# Altium project signal_conversion_board_2+3channels.PrjPcb
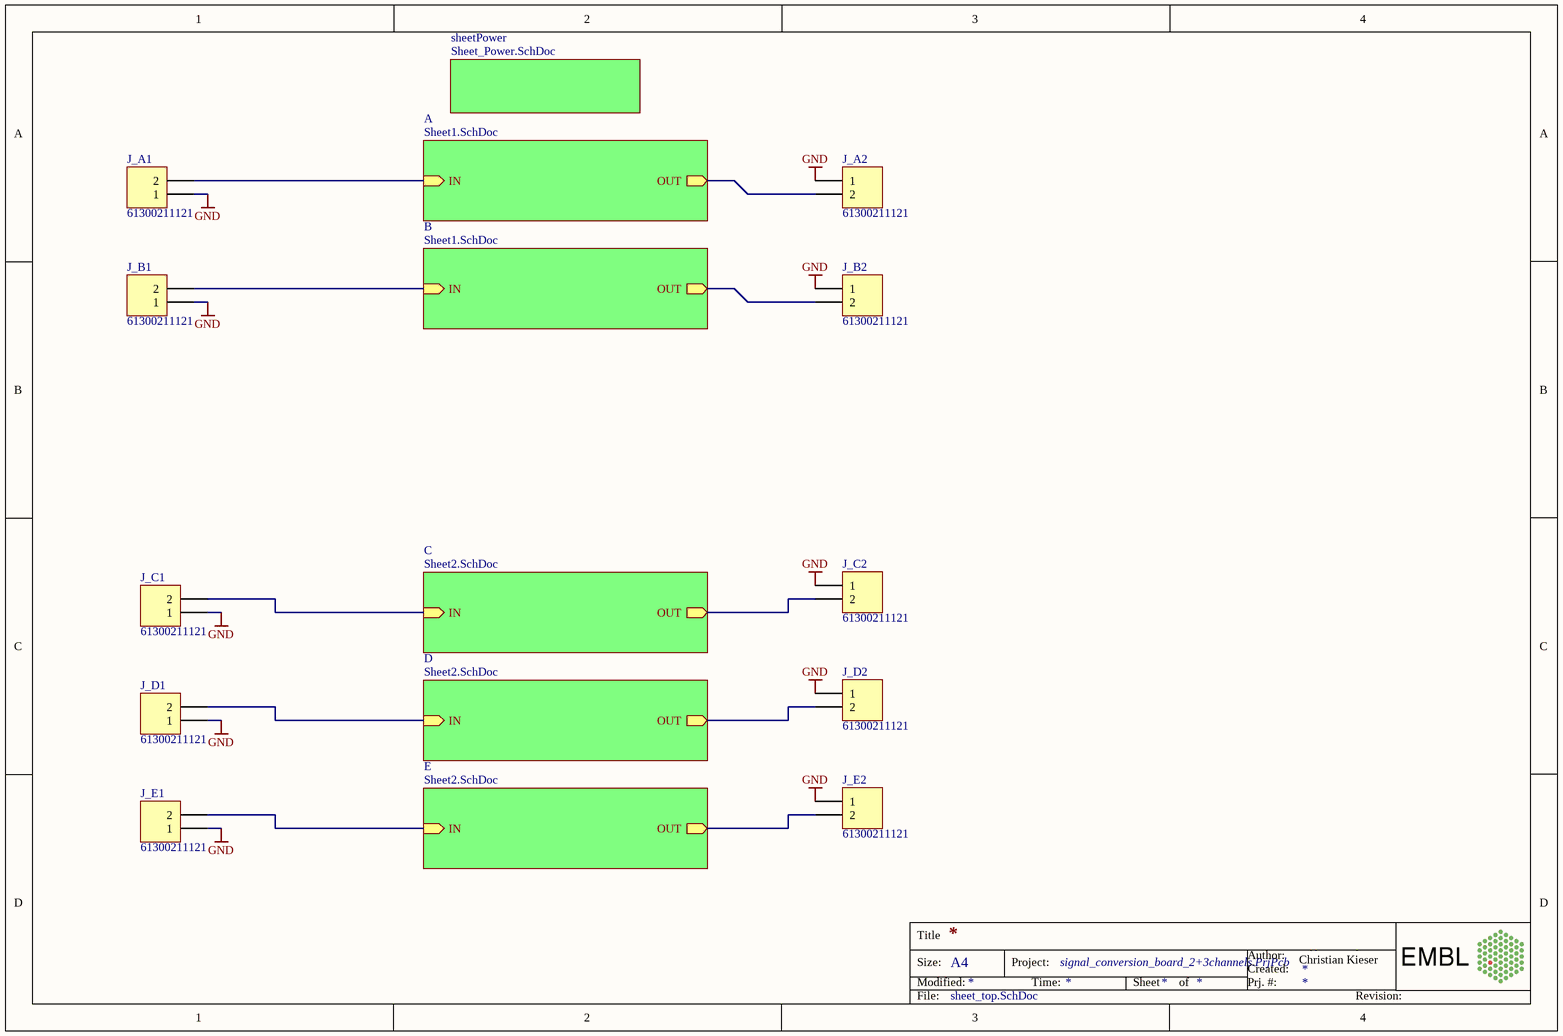
[diagram p0: sheet_top.SchDoc]
4 sheets, 112 parts. Net scope: hierarchical (ports join the sheet entries above them; power ports are global).
Board file: board.PcbDoc
Sheets:
  sheet_top.SchDoc
    sheetPower = Sheet_Power.SchDoc
    A = Sheet1.SchDoc
    B = Sheet1.SchDoc
    C = Sheet2.SchDoc
    D = Sheet2.SchDoc
    E = Sheet2.SchDoc

## Sheet sheet_top.SchDoc
size A4

### Parts
J_A1  61300211121  [61300211121]
J_A2  61300211121  [61300211121]
J_B1  61300211121  [61300211121]
J_B2  61300211121  [61300211121]
J_C1  61300211121  [61300211121]
J_C2  61300211121  [61300211121]
J_D1  61300211121  [61300211121]
J_D2  61300211121  [61300211121]
J_E1  61300211121  [61300211121]
J_E2  61300211121  [61300211121]

### Sub-sheets
A = Sheet1.SchDoc: OUT (out), IN (in)
B = Sheet1.SchDoc: OUT (out), IN (in)
C = Sheet2.SchDoc: OUT (out), IN (in)
D = Sheet2.SchDoc: OUT (out), IN (in)
E = Sheet2.SchDoc: OUT (out), IN (in)
sheetPower = Sheet_Power.SchDoc: no entries

### Nets
GND: J_A1.1 J_A2.1 J_B1.1 J_B2.1 J_C1.1 J_C2.1 J_D1.1 J_D2.1 J_E1.1 J_E2.1
NetJ11_A_2: J_A2.2 ; sheet A/OUT
NetJ11_B_2: J_B2.2 ; sheet B/OUT
NetJ_A1_2: J_A1.2 ; sheet A/IN
NetJ_B1_2: J_B1.2 ; sheet B/IN
NetJ_C1_2: J_C1.2 ; sheet C/IN
NetJ_C2_2: J_C2.2 ; sheet C/OUT
NetJ_D1_2: J_D1.2 ; sheet D/IN
NetJ_D2_2: J_D2.2 ; sheet D/OUT
NetJ_E1_2: J_E1.2 ; sheet E/IN
NetJ_E2_2: J_E2.2 ; sheet E/OUT

### Notes on the sheet
- Christian Kieser
- Title
- Size:
- Modified:
- A4
- Project:
- Time:
- Sheet
- of
- Created:
- Author:
- Prj. #:
- Alfons Riedinger
- File:
- Revision:

### Library data of the parts
J_A1 J_A2 J_B1 J_B2 J_C1 J_C2 J_D1 J_D2 J_E1 J_E2 = CMP-001-0071-1: 2Pol; gerade; WR-PHD 2.54 mm THT Pin Header; Brand: Wurth Electronics; Current Rating: 3 A; Insulation Resistance: 1 GOhms; Latching Type: Unlatched; Mating Post Length: 6 mm; Mounting Angle: Straight; Number of Positions: 2 Position; Pitch: 2.54 mm; Voltage Rating: 250 V; Accessory Type: -; Application: Wire to Board; ComponentLink1Description: 6130xx11121-538006.pdf; ComponentLink1URL: http://www.mouser.com/ds/2/445/6130xx11121-538006.pdf; Contact Gender: Pin (Male); Contact Material: Copper Alloy; Contact Plating: Gold; Contact Type: -; Flammability Rating: UL 94 V-0; Housing Gender: -; Housing Material: Polybutylene Terephthalate (PBT); Manufacturer: Wurth Electronics; Manufacturer Part Number: 61300211121; Minimum Order Quantity: 1; Mounting Style: Straight Pin; Number of Rows: 1 Row; Packaging: Bulk; Product: Headers; Reeling: False; RoHS - Mouser: Y; Row Spacing: -; Series: WR-PHD; Standard Pack Qty: 1000; Supplier: Mouser; Supplier Part Number: 710-61300211121; Termination Post Length: 3 mm; Termination Style: Through Hole; Type: Pin Strip; PartNumber: 61300211121

## Sheet Sheet_Power.SchDoc
size A4
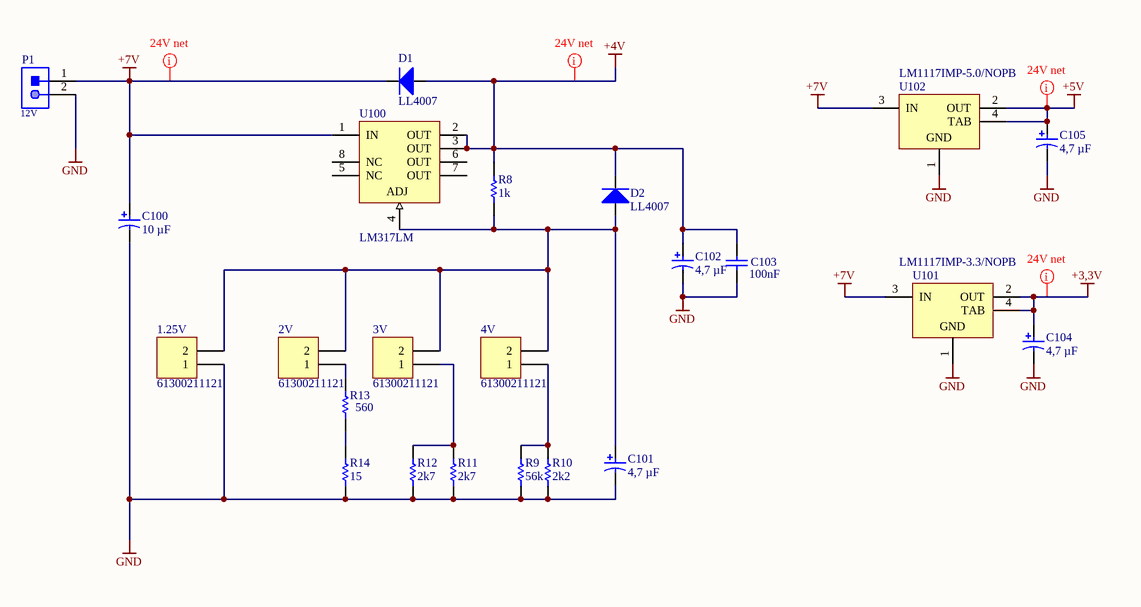
[diagram p1: Sheet_Power.SchDoc]

### Parts
1.25V  61300211121  [61300211121]
2V  61300211121  [61300211121]
3V  61300211121  [61300211121]
4V  61300211121  [61300211121]
C100  10 µF  [KEMT-520-D_Low]
C101  4,7 µF  [A Package]
C102  4,7 µF  [A Package]
C103  100nF  [CAPC2013X88X50ML20T25]
C104  4,7 µF  [A Package]
C105  4,7 µF  [A Package]
D1  LL4007  [LL4007]
D2  LL4007  [LL4007]
P1  12V  [66100211622]
R8  1k  [YAGO-RC0805_M]
R9  56k  [YAGO-RC0805_M]
R10  2k2  [YAGO-RC0805_M]
R11  2k7  [YAGO-RC0805_M]
R12  2k7  [YAGO-RC0805_M]
R13  560  [YAGO-RC0805_M]
R14  15  [YAGO-RC0805_M]
U100  LM317LM  [M08A_M]
U101  LM1117IMP-3.3/NOPB  [DCY0004A_N]
U102  LM1117IMP-5.0/NOPB  [DCY0004A_M]

### Nets
+3,3V: C104.1 U101.2(OUT) U101.4(TAB)
+4V: C102.1 C103.2 D1.1(A) D2.2(K) R8.2 U100.2(OUT) U100.3(OUT)
+5V: C105.1 U102.2(OUT) U102.4(TAB)
+7V: C100.1 D1.2(K) P1.1 U100.1(IN) U101.3(IN) U102.3(IN)
GND: 1.25V.1 C100.2 C101.2 C102.2 C103.1 C104.2 C105.2 P1.2 R9.1 R10.1 R11.1 R12.1 R14.1 U101.1(GND) U102.1(GND)
Net1.25V_2: 1.25V.2 2V.2 3V.2 4V.2 C101.1 D2.1(A) R8.1 U100.4(ADJ)
Net2V_1: 2V.1 R13.2
Net3V_1: 3V.1 R11.2 R12.2
Net4V_1: 4V.1 R9.2 R10.2
NetR13_1: R13.1 R14.2

Not connected (* = marked no-connect by the designer): U100 5(NC) 6(OUT) 7(OUT) 8(NC)

### Layout directives
net class 24V_net: +3,3V, +4V, +5V, +7V

### Library data of the parts
1.25V 2V 3V 4V = CMP-001-0071-1: as J_A1 on sheet sheet_top; Accessory Type: -; Application: Wire to Board; ComponentLink1Description: 6130xx11121-538006.pdf; ComponentLink1URL: http://www.mouser.com/ds/2/445/6130xx11121-538006.pdf; Contact Gender: Pin (Male); Contact Material: Copper Alloy; Contact Plating: Gold; Contact Type: -; Flammability Rating: UL 94 V-0; Housing Gender: -; Housing Material: Polybutylene Terephthalate (PBT); Manufacturer: Wurth Electronics; Manufacturer Part Number: 61300211121; Minimum Order Quantity: 1; Mounting Style: Straight Pin; Number of Rows: 1 Row; Packaging: Bulk; Product: Headers; Reeling: False; RoHS - Mouser: Y; Row Spacing: -; Series: WR-PHD; Standard Pack Qty: 1000; Supplier: Mouser; Supplier Part Number: 710-61300211121; Termination Post Length: 3 mm; Termination Style: Through Hole; Type: Pin Strip; PartNumber: 61300211121
C100 = CMP-001-0033-3: 10 µF, 35V, 125 mOhm, Gr. D / partnumb: T495D106K035ATE125; Manufacturer: KEMET; Capacitance: 10µF; Lifetime @ Temp.: 2000 Hrs @ 85°C; Tolerance: ±10%; Type: Molded; ComponentLink1Description: docfinder?Partnumber=T495D106K035ATE300; ComponentLink1URL: http://www.kemet.com/docfinder?Partnumber=T495D106K035ATE300; ESR (Equivalent Series Resistance): 125 mOhm; Failure Rate: -; Features: General Purpose; Height - Seated (Max): 0.122" (3.10mm); Lead Spacing: -; Manufacturer Size Code: D; Mounting Type: Surface Mount; Operating Temperature: -55°C ~ 125°C; Package / Case: 2917 (7343 Metric); Packaging: Cut Tape (CT); Part Status: Active; Size / Dimension: 0.287" L x 0.169" W (7.30mm x 4.30mm); Supplier: Digi-Key; Supplier Part Number: 399-10292-1-ND; Voltage - Rated: 35V; PartNumber: T495D106K035ATE125
C101 C102 C104 C105 = CMP-001-0039-3: 4,7 µF; 6V; Gr. A; T491A475K006AT; Manufacturer: KEMET; Capacitance: 4.7µF; ESR (Equivalent Series Resistance): 6 Ohm; Lifetime @ Temp.: 2000 Hrs @ 85°C; Tolerance: ±10%; Type: Molded; Voltage - Rated: 6.3V; ComponentLink1Description: KEM_T2005_T491.pdf; ComponentLink1URL: http://www.kemet.com/Lists/ProductCatalog/Attachments/254/KEM_T2005_T491.pdf; Failure Rate: -; Features: General Purpose; Height - Seated (Max): 0.071" (1.80mm); Lead Spacing: -; Manufacturer Size Code: A; Mounting Type: Surface Mount; Operating Temperature: -55°C ~ 125°C; Package / Case: 1206 (3216 Metric); Packaging: Cut Tape (CT); Part Status: Active; Size / Dimension: 0.126" L x 0.063" W (3.20mm x 1.60mm); Supplier: Digi-Key; Supplier Part Number: 399-9717-1-ND; PartNumber: T491A475K006AT
C103 = CMP-001-0082-2: generic 0805 COG oder X7R Vielschichtkondensatoren max. +/-10%
D1 D2 = CMP-001-0049-2: LL4007;  Vf 1,1V @ 1A, If = 1A; Manufacturer: TAIWAN SEMICONDUCTOR; PartNumber: LL4007G L2; Bauform - Diode: DO-213; Betriebstemperatur, max.: 175; Diodenkonfiguration: Einfach; Durchlassspannung Vf max.: 1.1; Durchlassstrom (mittlerer) If(AV): 1; Spitzendurchlassstrom Ifsm, max.: 25; SVHC: No SVHC (20-Jun-2016; Verpackung: Gurtabschnitt; Anzahl der Pins: -; ComponentLink1Description: 2182652.pdf; ComponentLink1URL: http://www.farnell.com/datasheets/2182652.pdf; Periodische Sperrspannung Vrrm, max.: 1; Produktpalette: -; Sperrerholzeit Trr, max.: -; Supplier: Farnell; Supplier Part Number: 2677381
P1 = CMP-001-0161-A.3: WR-WTB 2.54 mm Male Vertical Shrouded Header 2 Pins; Manufacturer: Wurth Electronics; Supplier Part Number: 732-14102-ND; PartNumber: 66100211622; Supplier: Digi-Key
R8-R14 = CMP-001-0027-2: 0805 Yageo Standard BlackBox Resistors; Power (Watts): 0.125W, 1/8W; Temperature Coefficient: ±200ppm/°C; Tolerance: ±1%; ComponentLink1Description: PYu-RC_Group_51_RoHS_L_7.pdf; Part Status: Active; Size / Dimension: 0.079" L x 0.049" W (2.00mm x 1.25mm); Supplier Device Package: 0805; ComponentLink1URL: http://www.yageo.com/documents/recent/PYu-RC_Group_51_RoHS_L_7.pdf; Composition: Thick Film; Failure Rate: -; Features: Moisture Resistant; Height - Seated (Max): 0.024" (0.60mm); Manufacturer: Yageo; Operating Temperature: -55°C ~ 155°C; Package / Case: 0805 (2012 Metric); Packaging: Digi-Reel®
U100 = CMP-001-0042-1: LM317LM/NOPB; 8PIN SOIC; 0,1A; Polarity: Positive; PSRR / Ripple Rejection - Typ: 80 dB; Brand: Texas Instruments; Input Voltage MAX: 40 V; Input Voltage MIN: 4.2 V; Line Regulation: 0.04 % / V; Load Regulation: 0.5 %; Number of Outputs: 1; Output Current: 100 mA; Output Type: Adjustable; Output Voltage: 1.2 V to 37 V; Packaging: Tube; Reeling: False; RoHS - Mouser: Y; Series: LM317L-N; Standard Pack Qty: 95; Supplier: Mouser; Supplier Part Number: 926-LM317LM/NOPB; PartNumber: LM317LM/NOPB; Manufacturer: Texas Instruments; Maximum Operating Temperature: + 125 C; Minimum Operating Temperature: - 40 C; Minimum Order Quantity: 1; Mounting Style: SMD/SMT; Operating Temperature Range: - 40 C to + 125 C; Package/Case: SOIC-8 Narrow
U101 = CMP-00484-1: 800mA Low-Dropout Linear Regulator, 4-pin SOT-223, Pb-Free; Manufacturer: Texas Instruments; PackageTopMarking: XYTT*N05B; PowerWise: N; High-Reliability: Y; CompType: LDO IC; Code_IPC: SOT223-4; PackageReference: DCY0004A; PinCount: 4; PackageDescription: Molded SOT-223, 6.50 x 3.56 x 1.6mm Body, 4 Lead, 2.3mm Pitch; PartNumber: LM1117IMP-3.3/NOPB; RoHS: Y; ComponentLink1Description: Datasheet URL; Code_JEDEC: TO-261-AA; ComponentLink1URL: http://www.ti.com/general/docs/lit/getliterature.tsp?genericPartNumber=LM1117-N&fileType=pdf
U102 = CMP-00485-1: 800mA Low-Dropout Linear Regulator, 4-pin SOT-223, Pb-Free; Manufacturer: Texas Instruments; PackageTopMarking: XYTT*N06B; CompType: LDO IC; PowerWise: N; High-Reliability: Y; RoHS: Y; Code_JEDEC: TO-261-AA; ComponentLink1URL: http://www.ti.com/general/docs/lit/getliterature.tsp?genericPartNumber=LM1117-N&fileType=pdf; Code_IPC: SOT223-4; ComponentLink1Description: Datasheet URL; PartNumber: LM1117IMP-5.0/NOPB; PackageReference: DCY0004A; PinCount: 4; PackageDescription: Molded SOT-223, 6.50 x 3.56 x 1.6mm Body, 4 Lead, 2.3mm Pitch

## Sheet Sheet1.SchDoc
size A4
Used 2 times, as channels A, B. Parts and nets are listed once, with the designators drawn on the sheet.
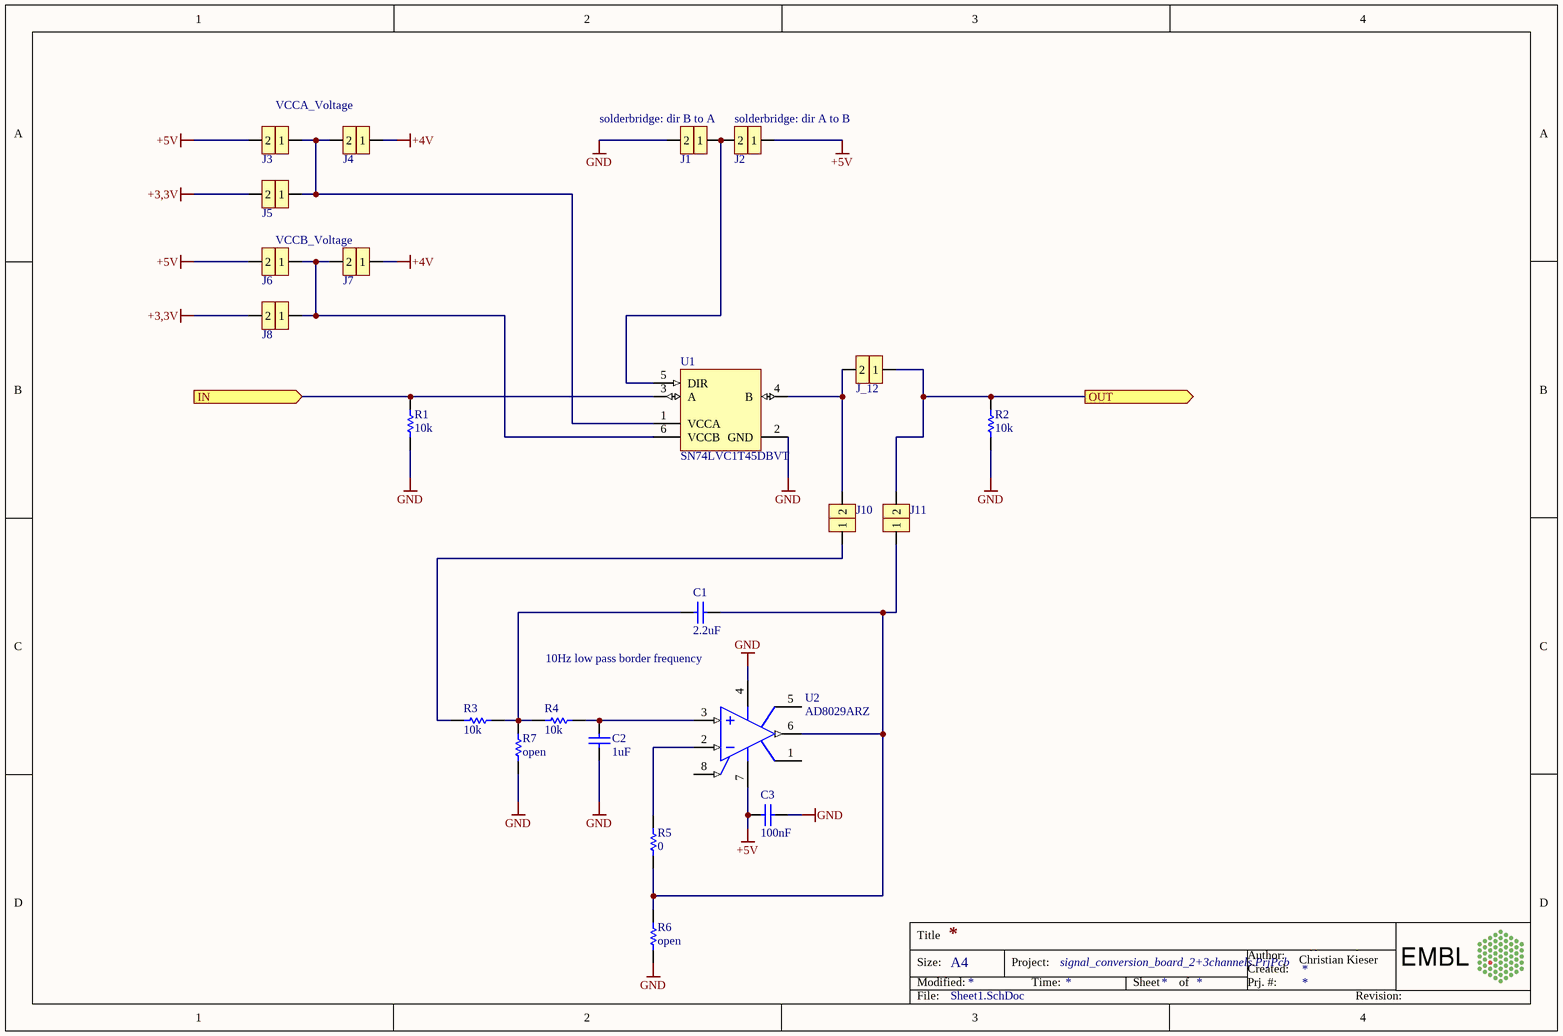
[diagram p2: Sheet1.SchDoc]

### Parts
C1  2.2uF  [CAPC1206(3216)190_M]
C2  1uF  [CAPC1206(3216)190_N]
C3  100nF  [CAPC2013X88X50ML20T25]
J1  normal solderbridge  [PCBComponent]  (value not drawn)
J2  normal solderbridge  [PCBComponent]  (value not drawn)
J3  normal solderbridge  [PCBComponent]  (value not drawn)
J4  normal solderbridge  [PCBComponent]  (value not drawn)
J5  normal solderbridge  [PCBComponent]  (value not drawn)
J6  normal solderbridge  [PCBComponent]  (value not drawn)
J7  normal solderbridge  [PCBComponent]  (value not drawn)
J8  normal solderbridge  [PCBComponent]  (value not drawn)
J10  normal solderbridge  [PCBComponent]  (value not drawn)
J11  normal solderbridge  [PCBComponent]  (value not drawn)
J_12  normal solderbridge  [PCBComponent]  (value not drawn)
R1  10k  [YAGO-RC0805_M]
R2  10k  [YAGO-RC0805_M]
R3  10k  [YAGO-RC0805_M]
R4  10k  [YAGO-RC0805_M]
R5  0  [YAGO-RC0805_M]
R6  open  [YAGO-RC0805_M]
R7  open  [YAGO-RC0805_M]
U1  SN74LVC1T45DBVT  [DBV0006A_M]
U2  AD8029ARZ  [ADI-R-8_L]

### Ports
IN (in), OUT (out)

### Nets
+3,3V: J5.2 J8.2
+4V: J4.1 J7.1
+5V: C3.2 J2.1 J3.2 J6.2 U2.7(+VS)
GND: C2.1 C3.1 J1.2 R1.1 R2.1 R6.2 R7.2 U1.2(GND) U2.4(-VS)
IN: R1.2 U1.3(A) ; port IN
OUT: J11.2 J_12.1 R2.2 ; port OUT
NetC1_1: C1.1 R3.1 R4.2 R7.1
NetC1_2: C1.2 J11.1 R5.2 R6.1 U2.6(VOUT)
NetC2_2: C2.2 R4.1 U2.3(+IN)
NetJ1_1: J1.1 J2.2 U1.5(DIR)
NetJ3_1: J3.1 J4.2 J5.1 U1.1(VCCA)
NetJ6_1: J6.1 J7.2 J8.1 U1.6(VCCB)
NetJ10_1: J10.1 R3.2
NetJ10_2: J10.2 J_12.2 U1.4(B)
NetR5_1: R5.1 U2.2(-IN)

Not connected (* = marked no-connect by the designer): U2 1(NC) 5(NC) 8(~{DISABLE})

### Channels
A: designators end in _A; ports IN=NetJ_A1_2 OUT=NetJ11_A_2
B: designators end in _B; ports IN=NetJ_B1_2 OUT=NetJ11_B_2

### Notes on the sheet
- VCCA_Voltage
- solderbridge: dir B to A
- (near J2) solderbridge: dir A to B
- VCCB_Voltage
- 10Hz low pass border frequency
- Christian Kieser
- Title
- Size:
- Modified:
- A4
- Project:
- Time:
- Sheet
- of
- Created:
- Author:
- Prj. #:
- Alfons Riedinger
- File:
- Revision:

### Library data of the parts
C1 = CMP-001-0162-A.1: CAP CER 2.2UF 10V X7R 1206; PartNumber: 885012208015; Manufacturer: Wurth Electronics; Tolerance: 10%; Capacitance: 2.2uF; Case Code (Imperial): 1206; Case Code (Metric): 3216; Case/Package: 1206; ComponentLink1Description: 885012208015.pdf?src-supplier=Digi-Key; ComponentLink1URL: https://katalog.we-online.de/pbs/datasheet/885012208015.pdf?src-supplier=Digi-Key; ComponentLink2Description: 2031893.pdf?src-supplier=Farnell; ComponentLink2URL: http://www.farnell.com/datasheets/2031893.pdf?src-supplier=Farnell; Length: 0.126inch; Max Operating Temperature: 125°C; Min Operating Temperature: -55°C; Mount: Surface Mount; Packaging: Tape and Reel; Supplier: Mouser; Supplier Part Number: 710-885012208015; Thickness: 0.051inch; Voltage Rating: 10V; Width: 0.063inch
C2 = CMP-001-0138-A.2: CAP CER 1UF 10V X7R 1206; Manufacturer: Wurth Electronics Inc.; Manufacturer Part Number: 885012208013; Notification: Current market demand for these product types have resulted in fluctuating and extending lead times. Lead times may differ.; Tolerance: ±10%; Applications: General Purpose; ComponentLink1Description: 885012208013.pdf; ComponentLink1URL: http://katalog.we-online.de/pbs/datasheet/885012208013.pdf; Features: -; Height - Seated (Max): -; Lead Spacing: -; Lead Style: -; Mounting Type: Surface Mount, MLCC; Operating Temperature: -55°C ~ 125°C; Package / Case: 1206 (3216 Metric); Packaging: Cut Tape (CT); Part Status: Active; Ratings: -; Size / Dimension: 0.126" L x 0.063" W (3.20mm x 1.60mm); Supplier: Digi-Key; Supplier Part Number: 732-7685-1-ND; Temperature Coefficient: X7R; Thickness (Max): 0.051" (1.30mm); Voltage - Rated: 10V; PartNumber: 885012208013
C3 = CMP-001-0082-2: as C103 on sheet Sheet_Power
J1-J8 J10 J11 J_12 = CMP-001-0133-A.1
R1-R7 = CMP-001-0027-2: as R8 on sheet Sheet_Power; ComponentLink1Description: PYu-RC_Group_51_RoHS_L_7.pdf; Part Status: Active; Size / Dimension: 0.079" L x 0.049" W (2.00mm x 1.25mm); Supplier Device Package: 0805; ComponentLink1URL: http://www.yageo.com/documents/recent/PYu-RC_Group_51_RoHS_L_7.pdf; Composition: Thick Film; Failure Rate: -; Features: Moisture Resistant; Height - Seated (Max): 0.024" (0.60mm); Manufacturer: Yageo; Operating Temperature: -55°C ~ 155°C; Package / Case: 0805 (2012 Metric); Packaging: Digi-Reel®
U1 = CMP-00491-2: Single-Bit Dual-Supply Bus Transceiver with Configurable Voltage Translation and 3-State Outputs, DBV0006A, SMALL T&R; Manufacturer: Texas Instruments; PartNumber: SN74LVC1T45DBVTG4; 3-State Output: Yes; VCC(Min)(V): 1.65; tpd @ Nom Voltage(Max)(ns): 15.5,8,5.8,4.4; Technology Family: LVC; Logic: True; Bits(#): 1; Rating: Catalog; Sub-Family: Dual Supply Translator; Schmitt Trigger: No; VCC(Max)(V): 5.5; Voltage(Nom)(V): 1.8,2.5,3.3,5; Output Drive (IOL/IOH)(Max)(mA): 32/-32; Input Type: CMOS/TTL; ICC @ Nom Voltage(Max)(mA): 0.004; Output Type: CMOS; F @ Nom Voltage(Max)(Mhz): 150; DatasheetVersion: SCES515K; Operating Temperature Range(C): -40 to 85; Generic Part Number: SN74LVC1T45; PackageReference: DBV0006A
U2 = CMP-00480-1: Single Channel RRIO Operational Amplifier, 125 MHz BW, 62 V/us SR, Industrial, 8-pin SOIC (R-8), Tube; Manufacturer: Analog Devices; Generic Part Number: AD8029; Slew Rate: 62V/us; V Span Min: 2.7V; Input Bias Current: 700nA; Amplifiers Per Package: 1; Iq/Amp: 1.5mA; V Span Max: 12V; Input Offset Voltage: 1.6mV; Small Signal Bandwidth: 125MHz; PackageVersion: 060506-A; ComponentLink3URL: http://www.analog.com/static/imported-files/packages/PKG_PDF/SOIC_Narrow%20(R)/R_8.pdf; ComponentLink1Description: Manufacturer URL; ComponentLink1URL: http://www.analog.com/en/index.html; Code_JEDEC: MS-012-AA; ComponentLink2URL: http://www.analog.com/static/imported-files/data_sheets/AD8029_8030_8040.pdf; ComponentLink3Description: Package Specification; PackageDescription: 8-Pin Standard Small Outline Package, Body 3.9 x 4.9 mm, Pitch 1.27 mm; PartNumber: AD8029ARZ; Mounting Technology: Surface Mount; PackageReference: R-8; DatasheetVersion: Rev. B; ComponentLink2Description: Datasheet

## Sheet Sheet2.SchDoc
size A4
Used 3 times, as channels C, D, E. Parts and nets are listed once, with the designators drawn on the sheet.
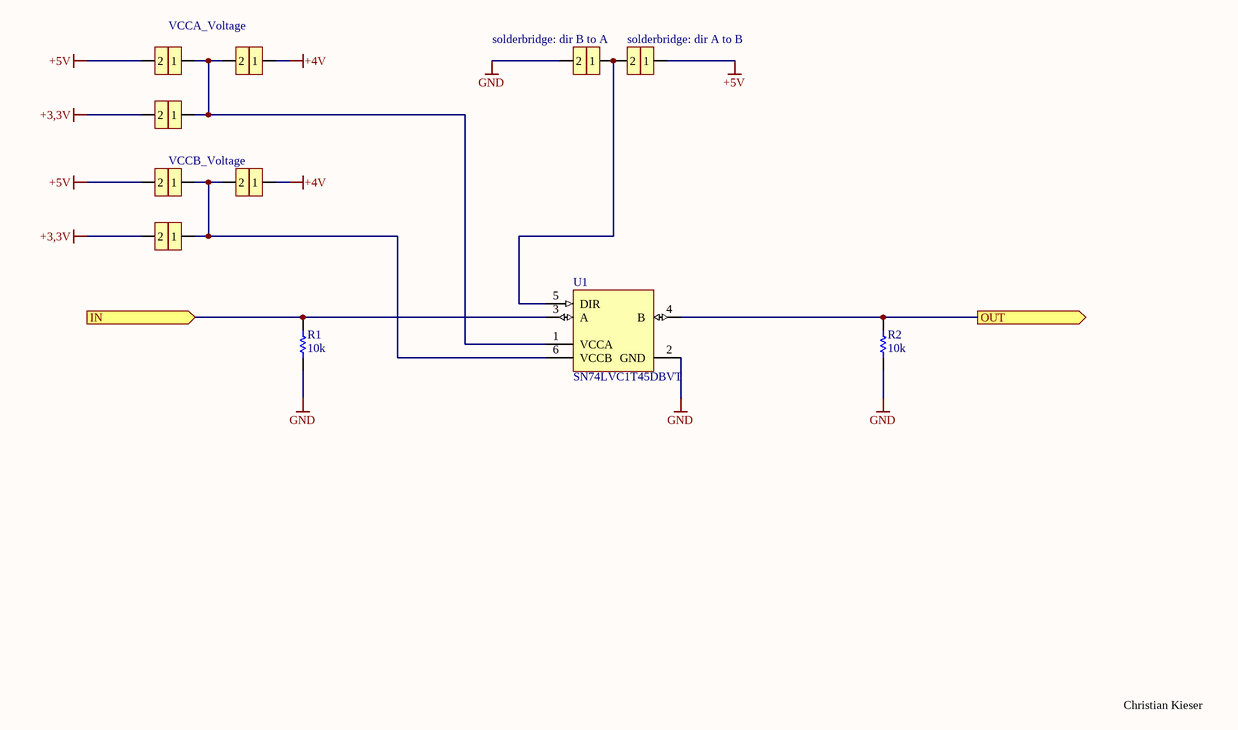
[diagram p3: Sheet2.SchDoc]

### Parts
J1  normal solderbridge  [PCBComponent]  (value not drawn)
J2  normal solderbridge  [PCBComponent]  (value not drawn)
J3  normal solderbridge  [PCBComponent]  (value not drawn)
J4  normal solderbridge  [PCBComponent]  (value not drawn)
J5  normal solderbridge  [PCBComponent]  (value not drawn)
J6  normal solderbridge  [PCBComponent]  (value not drawn)
J7  normal solderbridge  [PCBComponent]  (value not drawn)
J8  normal solderbridge  [PCBComponent]  (value not drawn)
R1  10k  [YAGO-RC0805_M]
R2  10k  [YAGO-RC0805_M]
U1  SN74LVC1T45DBVT  [DBV0006A_M]

### Ports
IN (in), OUT (out)

### Nets
+3,3V: J3.2 J6.2
+4V: J2.1 J5.1
+5V: J1.2 J4.2 J8.1
GND: J7.2 R1.1 R2.1 U1.2(GND)
IN: R1.2 U1.3(A) ; port IN
OUT: R2.2 U1.4(B) ; port OUT
NetJ1_1: J1.1 J2.2 J3.1 U1.1(VCCA)
NetJ4_1: J4.1 J5.2 J6.1 U1.6(VCCB)
NetJ7_1: J7.1 J8.2 U1.5(DIR)

### Channels
C: designators end in _C; ports IN=NetJ_C1_2 OUT=NetJ_C2_2
D: designators end in _D; ports IN=NetJ_D1_2 OUT=NetJ_D2_2
E: designators end in _E; ports IN=NetJ_E1_2 OUT=NetJ_E2_2

### Notes on the sheet
- VCCA_Voltage
- solderbridge: dir B to A
- (near J8) solderbridge: dir A to B
- VCCB_Voltage
- Christian Kieser
- Title
- Size:
- Modified:
- A4
- Project:
- Time:
- Sheet
- of
- Created:
- Author:
- Prj. #:
- Alfons Riedinger
- File:
- Revision:

### Library data of the parts
J1-J8 = CMP-001-0133-A.1
R1 R2 = CMP-001-0027-2: as R8 on sheet Sheet_Power; ComponentLink1Description: PYu-RC_Group_51_RoHS_L_7.pdf; Part Status: Active; Size / Dimension: 0.079" L x 0.049" W (2.00mm x 1.25mm); Supplier Device Package: 0805; ComponentLink1URL: http://www.yageo.com/documents/recent/PYu-RC_Group_51_RoHS_L_7.pdf; Composition: Thick Film; Failure Rate: -; Features: Moisture Resistant; Height - Seated (Max): 0.024" (0.60mm); Manufacturer: Yageo; Operating Temperature: -55°C ~ 155°C; Package / Case: 0805 (2012 Metric); Packaging: Digi-Reel®
U1 = CMP-00491-2: as U1 on sheet Sheet1; DatasheetVersion: SCES515K; Operating Temperature Range(C): -40 to 85; Generic Part Number: SN74LVC1T45; PackageReference: DBV0006A

## Nets that join several sheets
+3,3V: Sheet_Power (C104.1 U101.2 U101.4), A (J5_A.2 J8_A.2), B (J5_B.2 J8_B.2), C (J3_C.2 J6_C.2), D (J3_D.2 J6_D.2), E (J3_E.2 J6_E.2)
+4V: Sheet_Power (7 pins), A (J4_A.1 J7_A.1), B (J4_B.1 J7_B.1), C (J2_C.1 J5_C.1), D (J2_D.1 J5_D.1), E (J2_E.1 J5_E.1)
+5V: Sheet_Power (C105.1 U102.2 U102.4), A (5 pins), B (5 pins), C (J1_C.2 J4_C.2 J8_C.1), D (J1_D.2 J4_D.2 J8_D.1), E (J1_E.2 J4_E.2 J8_E.1)
GND: sheet_top (10 pins), Sheet_Power (15 pins), A (9 pins), B (9 pins), C (J7_C.2 R1_C.1 R2_C.1 U1_C.2), D (J7_D.2 R1_D.1 R2_D.1 U1_D.2), E (J7_E.2 R1_E.1 R2_E.1 U1_E.2)
NetJ11_A_2: sheet_top (J_A2.2), A (J11_A.2 J_12_A.1 R2_A.2)
NetJ11_B_2: sheet_top (J_B2.2), B (J11_B.2 J_12_B.1 R2_B.2)
NetJ_A1_2: sheet_top (J_A1.2), A (R1_A.2 U1_A.3)
NetJ_B1_2: sheet_top (J_B1.2), B (R1_B.2 U1_B.3)
NetJ_C1_2: sheet_top (J_C1.2), C (R1_C.2 U1_C.3)
NetJ_C2_2: sheet_top (J_C2.2), C (R2_C.2 U1_C.4)
NetJ_D1_2: sheet_top (J_D1.2), D (R1_D.2 U1_D.3)
NetJ_D2_2: sheet_top (J_D2.2), D (R2_D.2 U1_D.4)
NetJ_E1_2: sheet_top (J_E1.2), E (R1_E.2 U1_E.3)
NetJ_E2_2: sheet_top (J_E2.2), E (R2_E.2 U1_E.4)